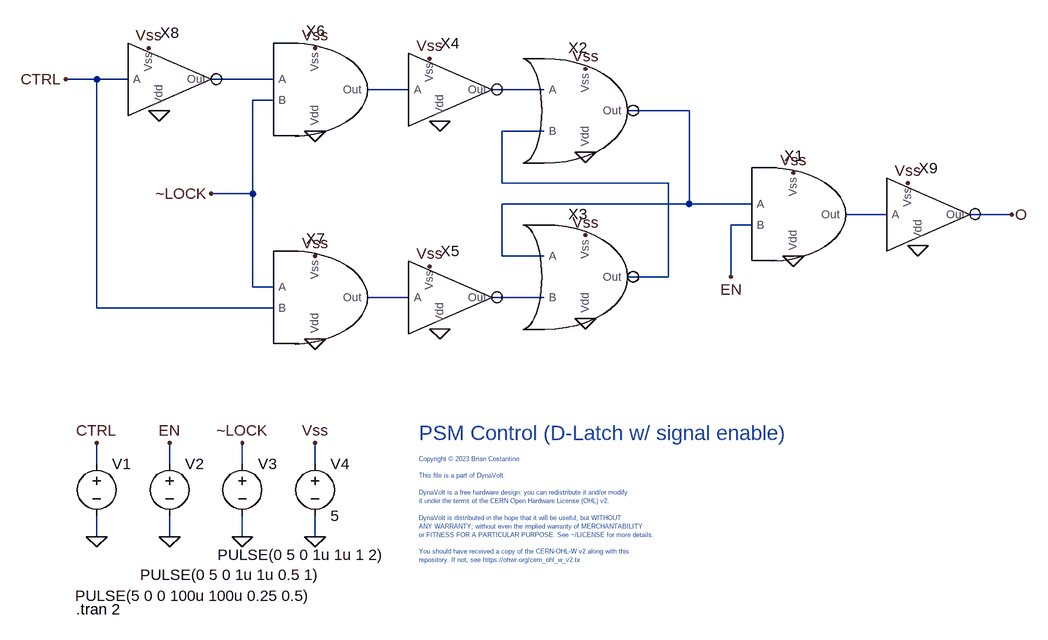
[diagram p0: schematic PMux-control-test-0_OLD.asc]
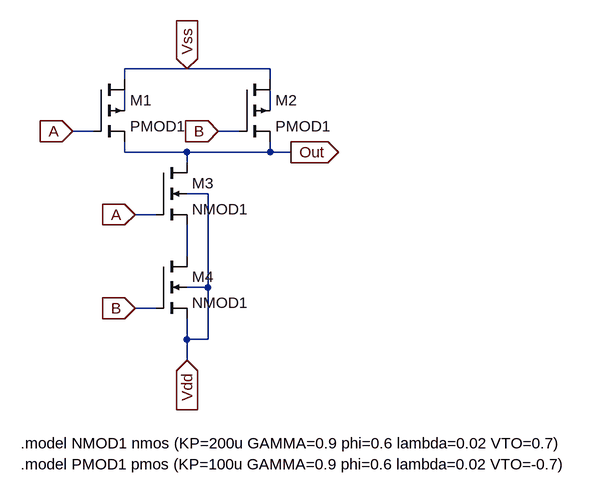
[diagram p1: sub-circuit cmos_nand.asc]
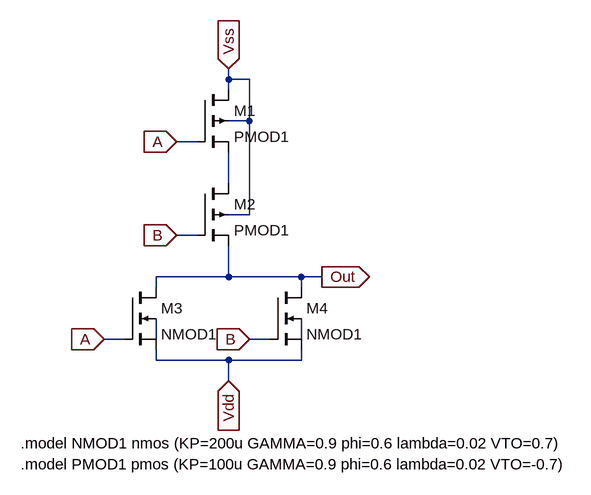
[diagram p2: sub-circuit cmos_nor.asc]
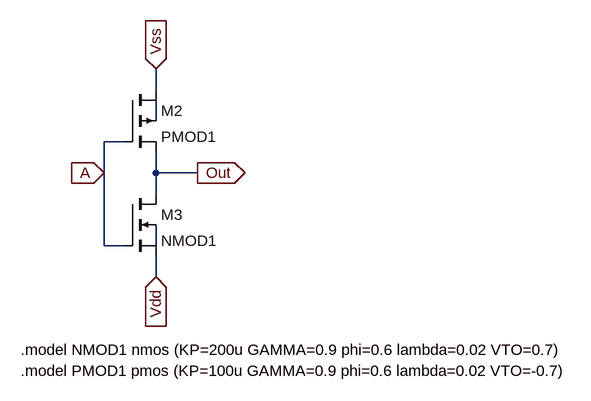
[diagram p3: sub-circuit cmos_inv.asc]
PMux-control-test-0_OLD.asc, the LTspice schematic file:
Version 4
SHEET 1 1588 680
WIRE -432 -480 -480 -480
WIRE -384 -480 -432 -480
WIRE -160 -480 -256 -480
WIRE 48 -464 -16 -464
WIRE 256 -464 176 -464
WIRE -160 -448 -192 -448
WIRE 480 -432 384 -432
WIRE 256 -400 192 -400
WIRE 192 -320 192 -400
WIRE 448 -320 192 -320
WIRE -192 -304 -192 -448
WIRE -192 -304 -256 -304
WIRE 480 -288 480 -432
WIRE 480 -288 192 -288
WIRE 576 -288 480 -288
WIRE 784 -272 720 -272
WIRE 976 -272 912 -272
WIRE 576 -256 544 -256
WIRE 192 -208 192 -288
WIRE 256 -208 192 -208
WIRE 448 -176 448 -320
WIRE 448 -176 384 -176
WIRE 544 -176 544 -256
WIRE -192 -160 -192 -304
WIRE -160 -160 -192 -160
WIRE 48 -144 -16 -144
WIRE 256 -144 176 -144
WIRE -432 -128 -432 -480
WIRE -160 -128 -432 -128
WIRE -432 112 -432 80
WIRE -320 112 -320 80
WIRE -208 112 -208 80
WIRE -96 112 -96 80
WIRE -432 224 -432 192
WIRE -320 224 -320 192
WIRE -208 224 -208 192
WIRE -96 224 -96 192
FLAG -208 224 0
FLAG -320 224 0
FLAG -432 224 0
FLAG -96 224 0
FLAG -96 80 Vss
FLAG -432 80 CTRL
FLAG -320 80 EN
FLAG -208 80 ~LOCK
FLAG 640 -208 0
FLAG 640 -336 Vss
FLAG 544 -176 EN
FLAG 976 -272 O
FLAG 320 -496 Vss
FLAG 320 -240 Vss
FLAG 80 -192 Vss
FLAG 80 -512 Vss
FLAG 320 -368 0
FLAG 320 -112 0
FLAG 96 -96 0
FLAG 96 -416 0
FLAG -96 -400 0
FLAG -96 -528 Vss
FLAG -96 -80 0
FLAG -96 -208 Vss
FLAG -352 -528 Vss
FLAG -336 -432 0
FLAG -256 -304 ~LOCK
FLAG -480 -480 CTRL
FLAG 816 -320 Vss
FLAG 832 -224 0
SYMBOL voltage -432 96 R0
WINDOW 3 -33 219 Left 2
WINDOW 123 0 0 Left 0
WINDOW 39 0 0 Left 0
SYMATTR Value PULSE(5 0 0 100u 100u 0.25 0.5)
SYMATTR InstName V1
SYMBOL voltage -320 96 R0
WINDOW 3 -45 187 Left 2
WINDOW 123 0 0 Left 0
WINDOW 39 0 0 Left 0
SYMATTR Value PULSE(0 5 0 1u 1u 0.5 1)
SYMATTR InstName V2
SYMBOL voltage -208 96 R0
WINDOW 3 -38 156 Left 2
WINDOW 123 0 0 Left 0
WINDOW 39 0 0 Left 0
SYMATTR Value PULSE(0 5 0 1u 1u 1 2)
SYMATTR InstName V3
SYMBOL voltage -96 96 R0
WINDOW 123 0 0 Left 0
WINDOW 39 0 0 Left 0
SYMATTR InstName V4
SYMATTR Value 5
SYMBOL CMOS_NAND 640 -272 R0
SYMATTR InstName X1
SYMBOL CMOS_NOR 304 -432 R0
SYMATTR InstName X2
SYMBOL CMOS_NOR 304 -176 R0
SYMATTR InstName X3
SYMBOL CMOS_INV 112 -464 R0
SYMATTR InstName X4
SYMBOL CMOS_INV 112 -144 R0
SYMATTR InstName X5
SYMBOL CMOS_NAND -96 -464 R0
SYMATTR InstName X6
SYMBOL CMOS_NAND -96 -144 R0
SYMATTR InstName X7
SYMBOL CMOS_INV -320 -480 R0
SYMATTR InstName X8
SYMBOL CMOS_INV 848 -272 R0
SYMATTR InstName X9
TEXT -464 336 Left 2 !.tran 2
TEXT 64 64 Left 3 ;PSM Control (D-Latch w/ signal enable)
TEXT 64 104 Left 0 ;Copyright © 2023 Brian Costantino\n \nThis file is a part of DynaVolt.\n \nDynaVolt is a free hardware design: you can redistribute it and/or modify \nit under the terms of the CERN Open Hardware License (OHL) v2.\n \nDynaVolt is distributed in the hope that it will be useful, but WITHOUT \nANY WARRANTY; without even the implied warranty of MERCHANTABILITY\nor FITNESS FOR A PARTICULAR PURPOSE. See ~/LICENSE for more details.\n \nYou should have received a copy of the CERN-OHL-W v2 along with this \nrepository. If not, see https://ohwr.org/cern_ohl_w_v2.tx

cmos_nand.asc, the sub-circuit schematic file:
Version 4
SHEET 1 880 680
WIRE 144 32 48 32
WIRE 272 32 144 32
WIRE 48 48 48 32
WIRE 272 48 272 32
WIRE 48 96 48 64
WIRE 272 96 272 64
WIRE 0 128 -32 128
WIRE 224 128 192 128
WIRE 48 160 48 144
WIRE 144 160 48 160
WIRE 272 160 272 144
WIRE 272 160 144 160
WIRE 304 160 272 160
WIRE 144 176 144 160
WIRE 176 224 144 224
WIRE 96 256 64 256
WIRE 144 320 144 272
WIRE 176 368 176 224
WIRE 176 368 144 368
WIRE 96 400 64 400
WIRE 144 448 144 416
WIRE 176 448 176 368
WIRE 176 448 144 448
WIRE 144 480 144 448
FLAG 144 32 Vss
IOPIN 144 32 In
FLAG 144 480 Vdd
IOPIN 144 480 In
FLAG -32 128 A
IOPIN -32 128 In
FLAG 64 256 A
IOPIN 64 256 In
FLAG 192 128 B
IOPIN 192 128 In
FLAG 64 400 B
IOPIN 64 400 In
FLAG 304 160 Out
IOPIN 304 160 Out
SYMBOL nmos4 96 176 R0
SYMATTR InstName M3
SYMATTR Value NMOD1
SYMATTR Value2 l=1u w=50u
SYMBOL nmos4 96 320 R0
SYMATTR InstName M4
SYMATTR Value NMOD1
SYMATTR Value2 l=1u w=50u
SYMBOL pmos4 0 48 R0
SYMATTR InstName M1
SYMATTR Value PMOD1
SYMATTR Value2 l=1u w=50u
SYMBOL pmos4 224 48 R0
SYMATTR InstName M2
SYMATTR Value PMOD1
SYMATTR Value2 l=1u w=50u
TEXT -112 640 Left 2 !.model PMOD1 pmos (KP=100u GAMMA=0.9 phi=0.6 lambda=0.02 VTO=-0.7)
TEXT -112 608 Left 2 !.model NMOD1 nmos (KP=200u GAMMA=0.9 phi=0.6 lambda=0.02 VTO=0.7)

cmos_nor.asc, the sub-circuit schematic file:
Version 4
SHEET 1 880 680
WIRE 208 48 208 32
WIRE 240 48 208 48
WIRE 208 64 208 48
WIRE 240 112 240 48
WIRE 240 112 208 112
WIRE 160 144 128 144
WIRE 208 208 208 160
WIRE 240 256 240 112
WIRE 240 256 208 256
WIRE 160 288 128 288
WIRE 208 352 208 304
WIRE 208 352 96 352
WIRE 320 352 208 352
WIRE 352 352 320 352
WIRE 96 368 96 352
WIRE 320 368 320 352
WIRE 48 448 16 448
WIRE 96 448 96 416
WIRE 272 448 240 448
WIRE 320 448 320 416
WIRE 96 480 96 464
WIRE 208 480 96 480
WIRE 320 480 320 464
WIRE 320 480 208 480
WIRE 208 512 208 480
FLAG 208 32 Vss
IOPIN 208 32 In
FLAG 208 512 Vdd
IOPIN 208 512 In
FLAG 16 448 A
IOPIN 16 448 In
FLAG 128 144 A
IOPIN 128 144 In
FLAG 240 448 B
IOPIN 240 448 In
FLAG 128 288 B
IOPIN 128 288 In
FLAG 352 352 Out
IOPIN 352 352 Out
SYMBOL nmos4 48 368 R0
SYMATTR InstName M3
SYMATTR Value NMOD1
SYMATTR Value2 l=1u w=25u
SYMBOL nmos4 272 368 R0
SYMATTR InstName M4
SYMATTR Value NMOD1
SYMATTR Value2 l=1u w=25u
SYMBOL pmos4 160 64 R0
SYMATTR InstName M1
SYMATTR Value PMOD1
SYMATTR Value2 l=1u w=100u
SYMBOL pmos4 160 208 R0
SYMATTR InstName M2
SYMATTR Value PMOD1
SYMATTR Value2 l=1u w=100u
TEXT -112 640 Left 2 !.model PMOD1 pmos (KP=100u GAMMA=0.9 phi=0.6 lambda=0.02 VTO=-0.7)
TEXT -112 608 Left 2 !.model NMOD1 nmos (KP=200u GAMMA=0.9 phi=0.6 lambda=0.02 VTO=0.7)

cmos_inv.asc, the sub-circuit schematic file:
Version 4
SHEET 1 880 680
WIRE 96 208 96 176
WIRE 96 256 96 224
WIRE 48 288 16 288
WIRE 16 336 16 288
WIRE 96 336 96 304
WIRE 160 336 96 336
WIRE 96 368 96 336
WIRE 16 448 16 336
WIRE 48 448 16 448
WIRE 96 448 96 416
WIRE 96 496 96 464
FLAG 96 176 Vss
IOPIN 96 176 In
FLAG 96 496 Vdd
IOPIN 96 496 In
FLAG 16 336 A
IOPIN 16 336 In
FLAG 160 336 Out
IOPIN 160 336 Out
SYMBOL nmos4 48 368 R0
SYMATTR InstName M3
SYMATTR Value NMOD1
SYMATTR Value2 l=1u w=25u
SYMBOL pmos4 48 208 R0
SYMATTR InstName M2
SYMATTR Value PMOD1
SYMATTR Value2 l=1u w=100u
TEXT -112 640 Left 2 !.model PMOD1 pmos (KP=100u GAMMA=0.9 phi=0.6 lambda=0.02 VTO=-0.7)
TEXT -112 608 Left 2 !.model NMOD1 nmos (KP=200u GAMMA=0.9 phi=0.6 lambda=0.02 VTO=0.7)

The netlist it stands for:
* PMux-control-test-0_OLD.asc
V1 CTRL 0 PULSE(5 0 0 100u 100u 0.25 0.5)
V2 EN 0 PULSE(0 5 0 1u 1u 0.5 1)
V3 ~LOCK 0 PULSE(0 5 0 1u 1u 1 2)
V4 Vss 0 5
XX1 N004 EN 0 Vss N006 cmos_nand
XX2 N003 N005 0 Vss N004 cmos_nor
XX3 N004 N008 0 Vss N005 cmos_nor
XX4 N002 0 Vss N003 cmos_inv
XX5 N007 0 Vss N008 cmos_inv
XX6 N001 ~LOCK 0 Vss N002 cmos_nand
XX7 ~LOCK CTRL 0 Vss N007 cmos_nand
XX8 CTRL 0 Vss N001 cmos_inv
XX9 N006 0 Vss O cmos_inv

* block symbol definitions
.subckt cmos_nand A B Vdd Vss Out
M3 Out A N003 Vdd NMOD1 l=1u w=50u
M4 N003 B Vdd Vdd NMOD1 l=1u w=50u
M1 Vss A Out N001 PMOD1 l=1u w=50u
M2 Vss B Out N002 PMOD1 l=1u w=50u
.model PMOD1 pmos (KP=100u GAMMA=0.9 phi=0.6 lambda=0.02 VTO=-0.7)
.model NMOD1 nmos (KP=200u GAMMA=0.9 phi=0.6 lambda=0.02 VTO=0.7)
.ends cmos_nand

.subckt cmos_nor A B Vdd Vss Out
M3 Out A Vdd N002 NMOD1 l=1u w=25u
M4 Out B Vdd N003 NMOD1 l=1u w=25u
M1 Vss A N001 Vss PMOD1 l=1u w=100u
M2 N001 B Out Vss PMOD1 l=1u w=100u
.model PMOD1 pmos (KP=100u GAMMA=0.9 phi=0.6 lambda=0.02 VTO=-0.7)
.model NMOD1 nmos (KP=200u GAMMA=0.9 phi=0.6 lambda=0.02 VTO=0.7)
.ends cmos_nor

.subckt cmos_inv A Vdd Vss Out
M3 Out A Vdd N002 NMOD1 l=1u w=25u
M2 Vss A Out N001 PMOD1 l=1u w=100u
.model PMOD1 pmos (KP=100u GAMMA=0.9 phi=0.6 lambda=0.02 VTO=-0.7)
.model NMOD1 nmos (KP=200u GAMMA=0.9 phi=0.6 lambda=0.02 VTO=0.7)
.ends cmos_inv

.model NMOS NMOS
.model PMOS PMOS
.lib standard.mos
.tran 2
* PSM Control (D-Latch w/ signal enable)
* Copyright © 2023 Brian Costantino
* This file is a part of DynaVolt.
* DynaVolt is a free hardware design: you can redistribute it and/or modify
* it under the terms of the CERN Open Hardware License (OHL) v2.
* DynaVolt is distributed in the hope that it will be useful, but WITHOUT
* ANY WARRANTY; without even the implied warranty of MERCHANTABILITY
* or FITNESS FOR A PARTICULAR PURPOSE. See ~/LICENSE for more details.
* You should have received a copy of the CERN-OHL-W v2 along with this
* repository. If not, see https://ohwr.org/cern_ohl_w_v2.tx
.backanno
.end